# Altium schematic sheet sd-card.SchDoc
size A
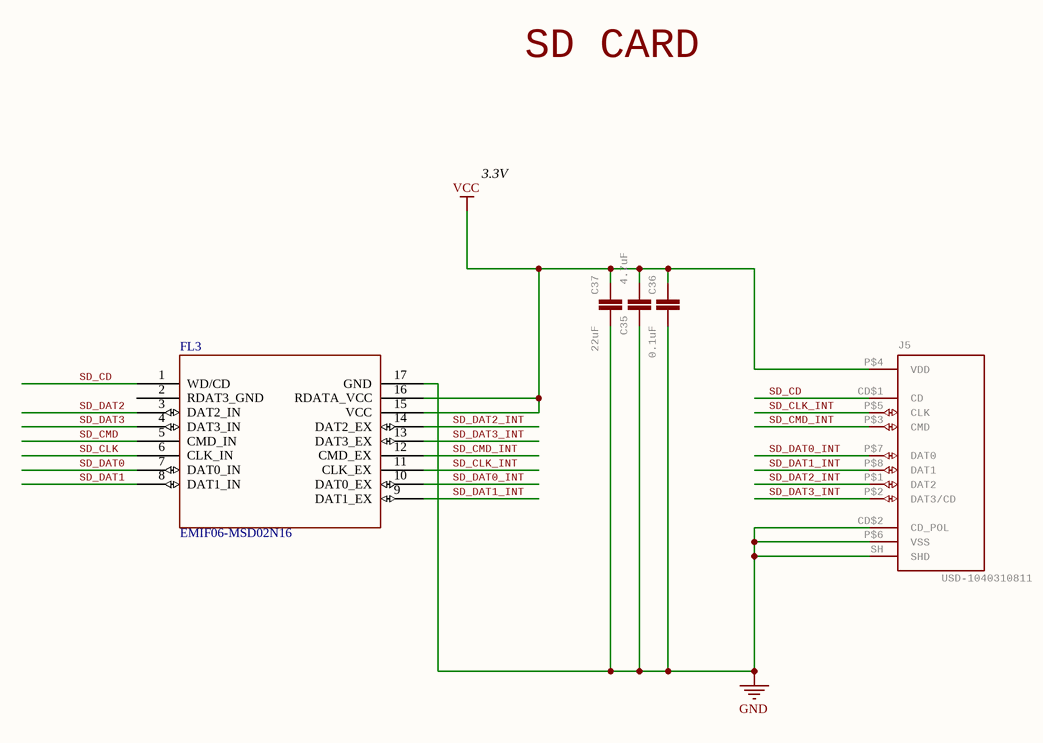
[diagram p0: sd-card.SchDoc]

## Parts
C35  4.7uF  [0402-CAP]
C36  0.1uF  [0402-CAP]
C37  22uF  [0805]
FL3  EMIF06-MSD02N16  [MICROQFN16_1p25x3p55x0p4_STM]
J5  USD-1040310811  [1040310811]

## Nets
GND: C35.1 C36.2 C37.2 FL3.17(GND) J5.CD$2(CD_POL) J5.P$6(VSS) J5.SH(SHD)
VCC: C35.2 C36.1 C37.1 FL3.15(VCC) FL3.16(RDATA_VCC) J5.P$4(VDD)
SD_CD: FL3.1(WD/CD) J5.CD$1(CD)
SD_CLK: FL3.6(CLK_IN)
SD_CLK_INT: FL3.11(CLK_EX) J5.P$5(CLK)
SD_CMD: FL3.5(CMD_IN)
SD_CMD_INT: FL3.12(CMD_EX) J5.P$3(CMD)
SD_DAT0: FL3.7(DAT0_IN)
SD_DAT0_INT: FL3.10(DAT0_EX) J5.P$7(DAT0)
SD_DAT1: FL3.8(DAT1_IN)
SD_DAT1_INT: FL3.9(DAT1_EX) J5.P$8(DAT1)
SD_DAT2: FL3.3(DAT2_IN)
SD_DAT2_INT: FL3.14(DAT2_EX) J5.P$1(DAT2)
SD_DAT3: FL3.4(DAT3_IN)
SD_DAT3_INT: FL3.13(DAT3_EX) J5.P$2(DAT3/CD)

Not connected (* = marked no-connect by the designer): FL3 2(RDAT3_GND)

## Notes on the sheet
- SD CARD
- 3.3V

## Library data of the parts
C35 = CAP0402-CAP: CapacitorStandard 0603 ceramic capacitor, and 0.1" leaded capacitor.; MPN: JMK105BBJ475MV-F; GateName_1: G$1; SymbolName_1: CAP; DeviceName: 0402-CAP; LibraryName: sfe; DeviceSetName: CAP; Part Number: JMK105BBJ475MV-F
C36 = C-EUC0201: CAPACITOR, European symbol; MPN: C0402C104Z4VAC; GateName_1: G$1; SymbolName_1: C-EU; POPULARITY: 0; LibraryName: rcl; DeviceSetName: C-EU; SPICEPREFIX: C; Part Number: C0402C104Z4VAC
C37 = 22UF-0805-6.3V-20%: 22ÂµF ceramic capacitors    A capacitor is a passive two-terminal electrical component used to store electrical energy temporarily in an electric field.; MPN: CL21A226MQQNNNE; GateName_1: G$1; SymbolName_1: CAP; PROD_ID: CAP-08402; DeviceName: -0805-6.3V-20%; LibraryName: SparkFun-Capacitors; DeviceSetName: 22UF; Part Number: CL21A226MQQNNNE
FL3 = EMIF06-MSD02N16: No Description Available; MPN: EMIF06-MSD02N16; Part Numbre: EMIF06-MSD02N16
J5 = USD-1040310811: uSD Slot; MPN: 104031-0811; GateName_1: G$1; SymbolName_1: USD; LibraryName: 1040310811; DeviceSetName: USD-1040310811; Part Number: 104031-0811